# EAGLE design atmega_copier (EAGLE 8.0.1)
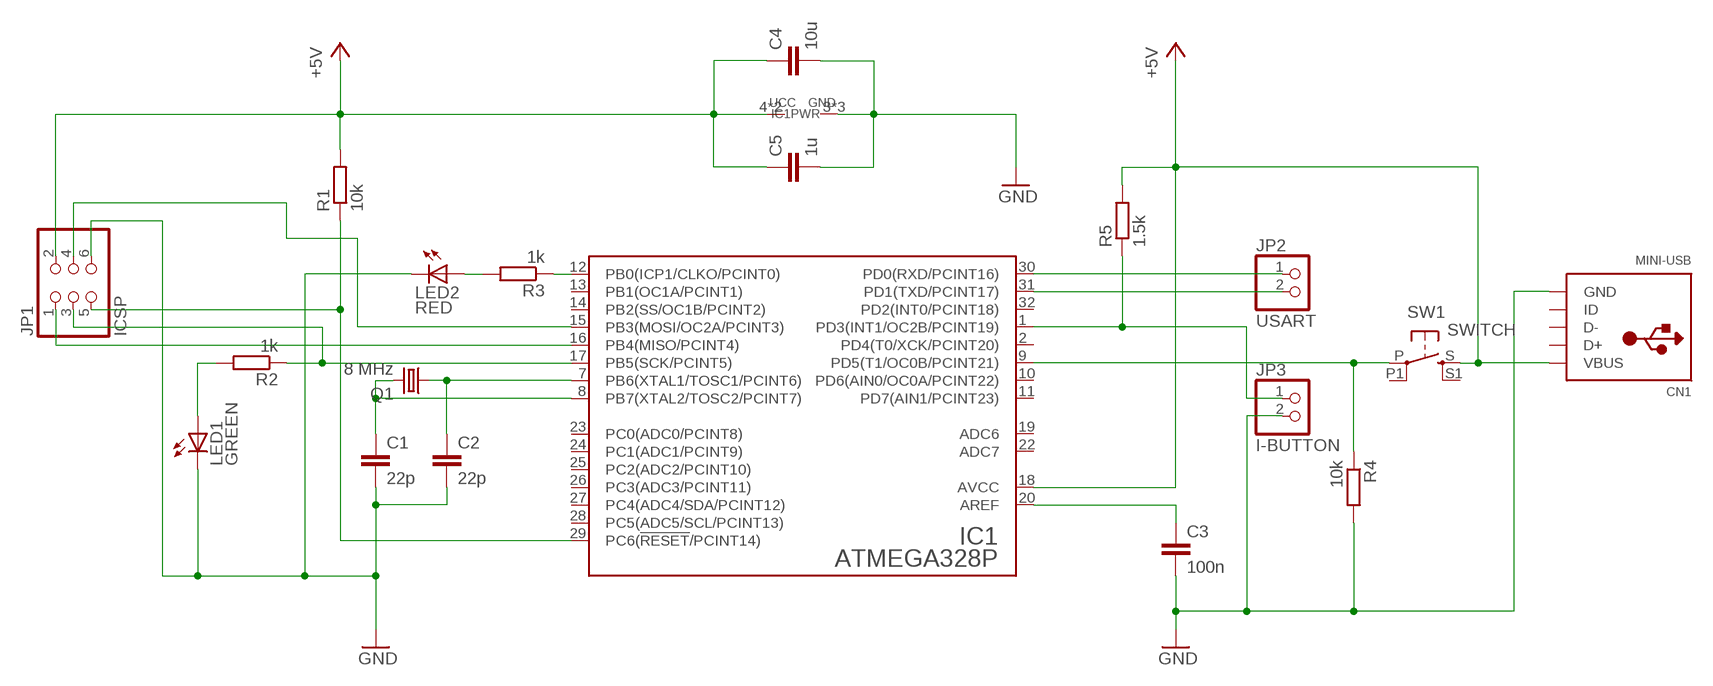
[diagram p0: schematic, sheet 1]

## Parts
C1  22p  C-EUC0805  [C0805]
C2  22p  C-EUC0805  [C0805]
C3  100n  C-EUC0805  [C0805]
C4  10u  C-EUC0805  [C0805]
C5  1u  C-EUC0805  [C0805]
CN1  MINI-USB  USBMINIB  [USB-MINIB]
IC1  ATMEGA328P  ATMEGA48/88/168/328-AU  [TQFP32-08]
JP1  ICSP  PINHD-2X3  [2X03]
JP2  USART  PINHD-1X2  [1X02]
JP3  I-BUTTON  PINHD-1X2  [1X02]
LED1  GREEN  LEDSML0805  [SML0805]
LED2  RED  LEDSML0805  [SML0805]
Q1  8 MHz  CRYSTALHC49UP  [HC49UP]
R1  10k  R-EU_R0805  [R0805]
R2  1k  R-EU_R0805  [R0805]
R3  1k  R-EU_R0805  [R0805]
R4  10k  R-EU_R0805  [R0805]
R5  1.5k  R-EU_R0805  [R0805]
SW1  SWITCH  10-XX-4.5SMD  [BT4.5X4.5]

## Nets
+5V [power]: C4.1 C5.1 CN1.VBUS IC1.4(UCC) IC1.6(UCC) IC1.18(AVCC) JP1.2 R1.2 R5.2 SW1.S
AREF: C3.1 IC1.20(AREF)
GND [power]: C1.2 C2.2 C3.2 C4.2 C5.2 CN1.GND IC1.3(GND) IC1.5(GND) IC1.21(GND) JP1.6 JP3.2 LED1.C LED2.C R4.2
KEY: IC1.9(PD5(T1/OC0B/PCINT21)) R4.1 SW1.P
MISO: IC1.16(PB4(MISO/PCINT4)) JP1.1
MOSI: IC1.15(PB3(MOSI/OC2A/PCINT3)) JP1.4
N$1: IC1.1(PD3(INT1/OC2B/PCINT19)) JP3.1 R5.1
N$13: LED1.A R2.2
N$20: LED2.A R3.2
RED_LED: IC1.12(PB0(ICP1/CLKO/PCINT0)) R3.1
RESET: IC1.29(PC6(!RESET!/PCINT14)) JP1.5 R1.1
RXD: IC1.30(PD0(RXD/PCINT16)) JP2.1
SCK: IC1.17(PB5(SCK/PCINT5)) JP1.3 R2.1
TXD: IC1.31(PD1(TXD/PCINT17)) JP2.2
XTAL1: C2.1 IC1.7(PB6(XTAL1/TOSC1/PCINT6)) Q1.1
XTAL2: C1.1 IC1.8(PB7(XTAL2/TOSC2/PCINT7)) Q1.2
Unconnected: CN1.D+ CN1.D- CN1.ID IC1.2(PD4(T0/XCK/PCINT20)) IC1.10(PD6(AIN0/OC0A/PCINT22)) IC1.11(PD7(AIN1/PCINT23)) IC1.13(PB1(OC1A/PCINT1)) IC1.14(PB2(SS/OC1B/PCINT2)) IC1.19(ADC6) IC1.22(ADC7) IC1.23(PC0(ADC0/PCINT8)) IC1.24(PC1(ADC1/PCINT9)) IC1.25(PC2(ADC2/PCINT10)) IC1.26(PC3(ADC3/PCINT11)) IC1.27(PC4(ADC4/SDA/PCINT12)) IC1.28(PC5(ADC5/SCL/PCINT13)) IC1.32(PD2(INT0/PCINT18)) SW1.P1 SW1.S1

## Library data of the parts
C1-C5 = resistor:C-EU: CAPACITOR, European symbol
CN1 = adafruit:USB: USB Connectors USBMINIB - Surface Mount Female Mini-B USB Connector 4UConnector: 06564 By microbuilder.eu Thru-hole RA Female Mini-B USB Connector 4UConnector: 18732 By ladyada.net
IC1 = atmel_tiny24-44-84tiny48-88mega48-88-168-328:ATMEGA48/88/168/328
JP1 = pinhead:PINHD-2X3: PIN HEADER
JP2 JP3 = pinhead:PINHD-1X2: PIN HEADER
LED1 LED2 = led:LED: LED OSRAM: - CHIPLED LG R971, LG N971, LY N971, LG Q971, LY Q971, LO R971, LY R971 LH N974, LH R974 LS Q976, LO Q976, LY Q976 LO Q996 - Hyper CHIPLED LW Q18S LB Q993, LB Q99A, LB R99A - SideLED LS A670, LO A670, LY A670, LG A670, LP A670 LB A673, LV A673, LT A673, LW A673 LH A674 LY A675 LS A676, LA A676, LO A676, LY A676, LW A676 LS A679, LY A679, LG A679 - Hyper Micro SIDELED® LS Y876, LA Y876, LO Y876, LY Y876 LT Y87S - SmartLED LW L88C, LW L88S LB L89C, LB L89S, LG L890 LS L89K, LO L89K, LY L89K LS L896, LA L896, LO L896, LY L896 - TOPLED LS T670, LO T670, LY T670, LG T670, LP T670 LSG T670, LSP T670, LSY T670, LOP T670, LYG T670 LG T671, LOG T671, LSG T671 LB T673, LV T673, LT T673, LW T673 LH T674 LS T676, LA T676, LO T676, LY T676, LB T676, LH T676, LSB T676, LW T676 LB T67C, LV T67C, LT T67C, LS T67K, LO T67K, LY T67K, LW E67C LS E67B, LA E67B, LO E67B, LY E67B, LB E67C, LV E67C, LT E67C LW T67C LS T679, LY T679, LG T679 LS T770, LO T770, LY T770, LG T770, LP T770 LB T773, LV T773, LT T773, LW T773 LH T774 LS E675, LA E675, LY E675, LS T675 LS T776, LA T776, LO T776, LY T776, LB T776 LHGB T686 LT T68C, LB T68C - Hyper Mini TOPLED® LB M676 - Mini TOPLED Santana® LG M470 LS M47K, LO M47K, LY M47K Source: http://www.osram.convergy.de LUXEON: - LUMILED® LXK2-PW12-R00, LXK2-PW12-S00, LXK2-PW14-U00, LXK2-PW14-V00 LXK2-PM12-R00, LXK2-PM12-S00, LXK2-PM14-U00 LXK2-PE12-Q00, LXK2-PE12-R00, LXK2-PE12-S00, LXK2-PE14-T00, LXK2-PE14-U00 LXK2-PB12-K00, LXK2-PB12-L00, LXK2-PB12-M00, LXK2-PB14-N00, LXK2-PB14-P00, LXK2-PB14-Q00 LXK2-PR12-L00, LXK2-PR12-M00, LXK2-PR14-Q00, LXK2-PR14-R00 LXK2-PD12-Q00, LXK2-PD12-R00, LXK2-PD12-S00 LXK2-PH12-R00, LXK2-PH12-S00 LXK2-PL12-P00, LXK2-PL12-Q00, LXK2-PL12-R00 Source: www.luxeon.com KINGBRIGHT: KA-3528ASYC Source: www.kingbright.com
Q1 = crystal:CRYSTAL: CRYSTAL; OC_FARNELL: unknown; OC_NEWARK: unknown
R1-R5 = resistor:R-EU_: RESISTOR, European symbol
SW1 = buttons:10-XX: OMRON SWITCH

## Net classes
0 default: width 0.6 mm, drill 0.9 mm
1 power: width 0.6 mm, drill 0.9 mm

## Board
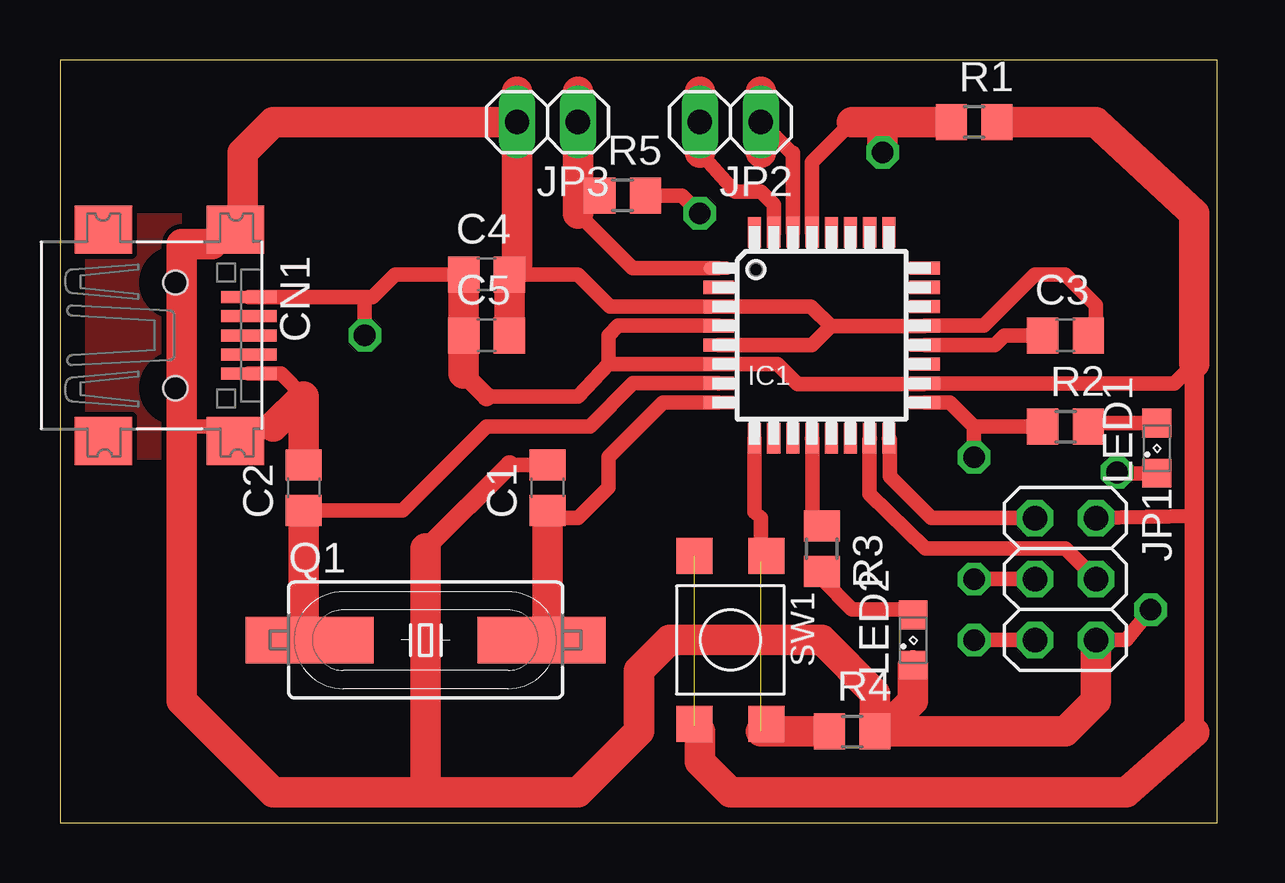
[diagram p1: board, top side]
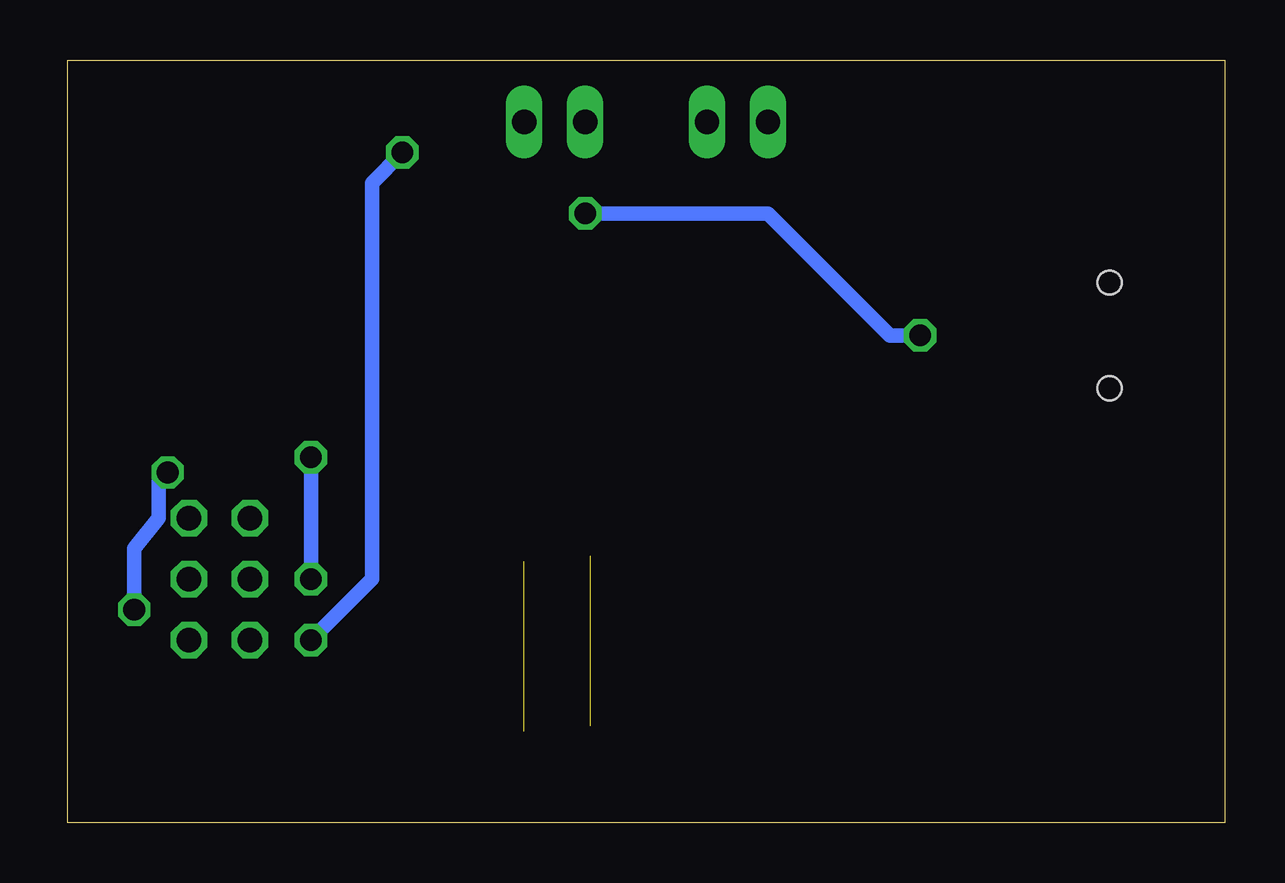
[diagram p2: board, bottom side, seen from below]

Size 48.24 x 31.8 mm. Coordinates in mm from the lower left corner, seen from the top.
Outline: 0,0 48.24,0 48.24,31.8 0,31.8 0,0
Copper layers (1*16): Top 0.035mm / dielectric 1.5mm / Bottom 0.035mm
Design rules "default *": minimum track width 10mil, minimum drill 24mil, track to track 8mil, track to pad 8mil, pad to pad 8mil, via to via 8mil, smd to smd 8mil, copper to edge 40mil, drill to drill 8mil, minimum pad ring 10mil, minimum via ring 8mil, stop-mask expansion 4mil, vias tented up to drill 0.1mm, thermal gap 10mil

### Footprints (pad centres in the part's own frame; a part is rotated, then mirrored left to right if it is on the bottom)
C0805 = smd 1.3 x 1.5: 1 -0.95,0; 2 0.95,0
USB-MINIB = smd 0.5 x 2.308: D+ 0,4.064; D- -0.8,4.064; GND 1.6,4.064; ID 0.8,4.064; VBUS -1.6,4.064 | smd 2 x 2.4: GND1 -4.4,-2; GND2 -4.4,3.5; GND3 4.4,3.5; GND4 4.4,-2 | hole 1: -2.2,1; 2.2,1
TQFP32-08 = smd 1.27 x 0.55: 1 -4.293,2.8; 2 -4.293,2; 3 -4.293,1.2; 4 -4.293,0.4; 5 -4.293,-0.4; 6 -4.293,-1.2; 7 -4.293,-2; 8 -4.293,-2.8; 17 4.293,-2.8; 18 4.293,-2; 19 4.293,-1.2; 20 4.293,-0.4; 21 4.293,0.4; 22 4.293,1.2; 23 4.293,2; 24 4.293,2.8 | smd 0.55 x 1.27: 9 -2.8,-4.293; 10 -2,-4.293; 11 -1.2,-4.293; 12 -0.4,-4.293; 13 0.4,-4.293; 14 1.2,-4.293; 15 2,-4.293; 16 2.8,-4.293; 25 2.8,4.293; 26 2,4.293; 27 1.2,4.293; 28 0.4,4.293; 29 -0.4,4.293; 30 -1.2,4.293; 31 -2,4.293; 32 -2.8,4.293
2X03 = drill 1.016 octagon: 1 -2.54,-1.27; 2 -2.54,1.27; 3 0,-1.27; 4 0,1.27; 5 2.54,-1.27; 6 2.54,1.27
1X02 = drill 1.016 long: 1 -1.27,0; 2 1.27,0
SML0805 = smd 1.2 x 1.2: A 1.05,0; C -1.05,0
HC49UP = smd 5.334 x 1.93: 1 -4.826,0; 2 4.826,0
R0805 = smd 1.3 x 1.5: 1 -0.95,0; 2 0.95,0
BT4.5X4.5 = smd 1.5 x 1.5: P -3.5,1.5; P1 3.5,1.5; S -3.5,-1.5; S1 3.5,-1.5

### Placement (x,y rotation side)
C1  20.32,13.97 90 top
C2  10.16,13.97 90 top
C3  41.91,20.32 0 top
C4  17.78,22.86 0 top
C5  17.78,20.32 0 top
CN1  3.81,20.32 270 top
IC1  31.75,20.32 0 top
JP1  41.91,10.16 270 top
JP2  27.94,29.21 180 top
JP3  20.32,29.21 180 top
LED1  45.72,15.62 90 top
LED2  35.56,7.62 90 top
Q1  15.24,7.62 0 top
R1  38.1,29.21 0 top
R2  41.91,16.51 0 top
R3  31.75,11.43 270 top
R4  33.02,3.81 0 top
R5  23.45,26.15 0 top
SW1  27.94,7.62 270 top

### Tracks (layer width: path | path; a pad name or v marks a point on that pad's centre or on a via)
+5V  (via drill 0.9)  (1 unrouted)
  Top 0.61: 12.7,21.92 CN1.VBUS | 12.7,21.92 13.03,21.92 13.97,22.86 C4.1 | 17.78,17.78 21.59,17.78 22.86,19.13 | 22.86,19.13 27.39,19.13 IC1.6 29.9,19.12 30.73,18.29 36.01,18.29 IC1.18 46.45,18.32 47.29,19.15 | IC1.4 23.26,20.72 22.86,20.32 22.86,19.13 | 26.67,3.81 26.44,4.04 | 47.29,12.8 JP1.2 | R5.2 25.92,26.15 v26.67,25.4 | v12.7,20.32 12.7,21.92
  Top 0.813: 16.83,18.73 17.78,17.78 | 47.29,19.15 47.29,12.8 47.29,3.76
  Top 1.27: C4.1 C5.1 16.83,18.73 | 26.67,3.81 26.67,2.54 27.94,1.27 44.45,1.27 47.29,3.76 | R1.2 43.18,29.21 47.29,25.4 47.29,19.15
  Bottom 0.61: v26.67,25.4 19.05,25.4 13.97,20.32 v12.7,20.32
AREF
  Top 0.61: IC1.20 38.97,19.92 39.37,20.32 C3.1
GND  (via drill 0.9)
  Top 0.61: CN1.GND 9.22,18.72 10.16,17.78 | IC1.5 31.35,19.92 32.13,20.7 | 32.13,20.7 36.02,20.7 IC1.21 38.5,20.72 40.64,22.86 41.91,22.86 43.18,21.59 43.18,20.64 C3.2 | 32.13,20.7 31.31,21.52 IC1.3 22.93,21.52 21.59,22.86 C4.2 19.05,23.18 | 6.35,24.13 7.62,25.4 | 8.89,16.51 5.08,16.51 | 34.29,3.81 R4.2 | C1.2 18.73,14.92 | LED1.C 44.1,14.57 v44.07,14.61 | JP1.6 44.45,7.62 v45.47,8.89
  Top 0.813: 18.73,14.92 15.24,11.43
  Top 1.27: C2.2 10.16,17.78 8.89,16.51 | 19.05,23.18 JP3.2 | C4.2 C5.2 | 6.35,24.13 5.08,24.13 5.08,16.51 5.08,5.08 8.89,1.27 15.24,1.27 | 7.62,25.4 7.62,27.94 8.89,29.21 JP3.2 | LED2.C 35.56,5.08 34.29,3.81 41.91,3.81 43.18,5.08 JP1.6 | 15.24,11.43 15.24,1.27 | R4.2 33.97,5.4 31.75,7.62 25.4,7.62 24.13,6.35 24.13,3.81 21.59,1.27 15.24,1.27 | JP3.2 19.05,30.48
  Bottom 0.61: v45.47,8.89 45.47,11.43 44.45,12.7 44.45,14.22 v44.07,14.61
KEY  (1 unrouted)
  Top 0.61: IC1.9 28.95,12.96 29.21,12.7 29.21,11.35 SW1.P 29.21,10.89
  Top 1.27: R4.1 29.21,3.81
MISO
  Top 0.61: JP1.1 36.32,12.7 34.59,14.43 34.59,15.97 IC1.16
MOSI
  Top 0.61: JP1.4 41.91,11.43 36.07,11.43 33.73,13.72 33.73,15.99 IC1.15
N$1
  Top 0.61: IC1.1 23.87,23.12 21.59,25.4 | R5.1 21.59,26.15 21.59,26.67
  Top 1.27: 21.59,25.4 21.59,26.67 JP3.1 21.59,30.48
N$2
  pour Top: 5.08,25.4 0.7,25.4 0.7,25.35 0.55,25.35 0.55,15.15 5.08,15.15
N$13
  Top 0.61: LED1.A 43.02,16.67 R2.2
N$20
  Top 0.61: R3.2 31.75,10.16 33.02,8.89 35.34,8.89 LED2.A
RED_LED
  Top 0.61: IC1.12 31.37,16.01 31.37,12.76 R3.1
RESET  (via drill 0.9)
  Top 0.61: IC1.29 31.35,27.54 33.02,29.21 | JP1.5 v38.1,7.62
  Top 1.27: 34.29,29.21 33.02,29.21 | 34.29,29.21 R1.1 | v34.29,27.94 34.29,29.21
  Bottom 0.61: v38.1,7.62 35.56,10.16 35.56,26.67 v34.29,27.94
RXD
  Top 0.61: IC1.30 30.56,24.68 30.56,27.94 30.48,27.94 JP2.1 29.21,30.48
  Top 1.27: 29.21,30.48 29.21,27.94
SCK  (via drill 0.9)
  Top 0.61: IC1.17 37.09,17.52 38.1,16.51 | 38.1,16.51 R2.1 40.64,16.19 | 38.1,16.51 v38.1,15.24 | JP1.3 v38.1,10.16
  Bottom 0.61: v38.1,10.16 v38.1,15.24
TXD
  Top 0.61: IC1.31 29.75,25.78 29.21,26.32 28.14,26.32 26.67,27.94
  Top 1.27: 26.67,27.94 JP2.2 26.67,30.48
XTAL1
  Top 0.61: C2.1 14.29,13.02 17.78,16.51 22.1,16.51 23.88,18.34 27.43,18.34 IC1.7 | 10.16,7.87 Q1.1
  Top 1.27: C2.1 10.16,7.87
XTAL2
  Top 0.61: IC1.8 25.14,17.52 22.86,15.24 22.86,13.97 21.59,12.7 20.64,12.7 C1.1 | 20.32,7.87 Q1.2
  Top 1.27: C1.1 20.32,7.87